# Altium schematic sheet MCU.SchDoc
size A4
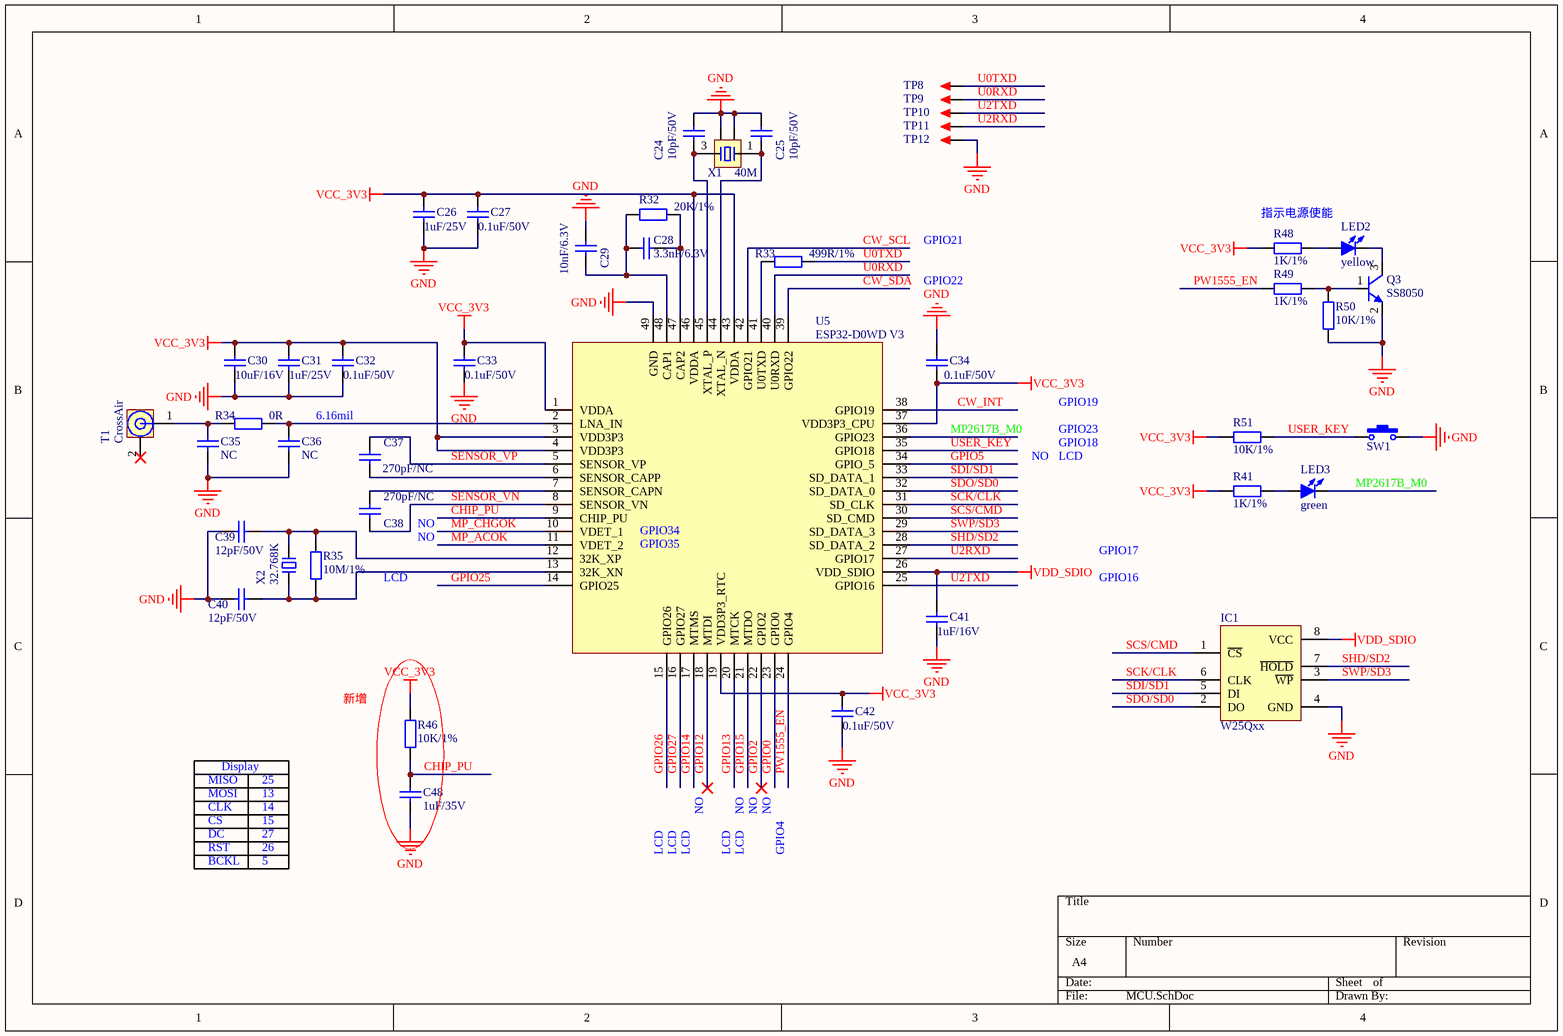
[diagram p0: MCU.SchDoc]

## Parts
C24  10pF/50V  [C0402_L]
C25  10pF/50V  [C0402_L]
C26  1uF/25V  [C0402_L]
C27  0.1uF/50V  [C0402_L]
C28  3.3nF/6.3V  [C0402_L]
C29  10nF/6.3V  [C0402_L]
C30  10uF/16V  [C0603_L]
C31  1uF/25V  [C0402_L]
C32  0.1uF/50V  [C0402_L]
C33  0.1uF/50V  [C0402_L]
C34  0.1uF/50V  [C0402_L]
C35  NC  [C0402_L]
C36  NC  [C0402_L]
C37  270pF/NC  [C0402_L]
C38  270pF/NC  [C0402_L]
C39  12pF/50V  [C0402_L]
C40  12pF/50V  [C0402_L]
C41  1uF/16V  [C0402_L]
C42  0.1uF/50V  [C0402_L]
C48  1uF/35V  [C0402_L]
IC1  W25Qxx  [SOP8W_L]
LED2  yellow  [LED0402]
LED3  green  [LED0402]
Q3  SS8050  [SOT23-3L]
R32  20K/1%  [R0402_L]
R33  499R/1%  [R0402_L]
R34  0R  [R0402_L]
R35  10M/1%  [R0402_L]
R41  1K/1%  [R0402_L]
R46  10K/1%  [R0402_L]
R48  1K/1%  [R0402_L]
R49  1K/1%  [R0402_L]
R50  10K/1%  [R0402_L]
R51  10K/1%  [R0402_L]
SW1  小龟侧按3x4  [小龟开关侧按键2脚贴片]  (value not drawn)
T1  CrossAir  [CA-C03]
TP8  TEST  [TEST 1]  (value not drawn)
TP9  TEST  [TEST 1]  (value not drawn)
TP10  TEST  [TEST 1]  (value not drawn)
TP11  TEST  [TEST 1]  (value not drawn)
TP12  TEST  [TEST 1]  (value not drawn)
U5  ESP32-D0WD V3  [QFN48_ESP32]
X1  40M  [XTAL-3225-4P]
X2  32.768K  [XTAL-3215-2P]

## Nets
GND: C24.2 C25.2 C26.1 C27.1 C29.2 C30.1 C31.1 C32.1 C33.1 C34.2 C35.1 C36.1 C39.1 C40.1 C41.1 C42.1 C48.1 IC1.4(GND) Q3.2(E) R50.1 SW1.2 TP12.1 U5.49(GND) X1.2 X1.4
VCC_3V3: C26.2 C27.2 C30.2 C31.2 C32.2 C33.2 C34.1 C42.2 R41.1 R46.2 R48.2 R51.1 U5.1(VDDA) U5.3(VDD3P3) U5.4(VDD3P3) U5.19(VDD3P3_RTC) U5.37(VDD3P3_CPU) U5.43(VDDA) U5.46(VDDA)
VDD_SDIO: C41.2 IC1.8(VCC) U5.26(VDD_SDIO)
CHIP_PU: C48.2 R46.1 U5.9(CHIP_PU)
CW_INT: U5.38(GPIO19)
CW_SCL: U5.42(GPIO21)
CW_SDA: U5.39(GPIO22)
GPIO0: U5.23(GPIO0)
GPIO2: U5.22(GPIO2)
GPIO5: U5.34(GPIO_5)
GPIO12: U5.18(MTDI)
GPIO13: U5.20(MTCK)
GPIO14: U5.17(MTMS)
GPIO15: U5.21(MTDO)
GPIO25: U5.14(GPIO25)
GPIO26: U5.15(GPIO26)
GPIO27: U5.16(GPIO27)
MP2617B_M0: LED3.2(K) U5.36(GPIO23)
MP_ACOK: U5.11(VDET_2)
MP_CHGOK: U5.10(VDET_1)
PW1555_EN: R49.1 U5.24(GPIO4)
SCK/CLK: IC1.6(CLK) U5.31(SD_CLK)
SCS/CMD: IC1.1(~{CS}) U5.30(SD_CMD)
SDI/SD1: IC1.5(DI) U5.33(SD_DATA_1)
SDO/SD0: IC1.2(DO) U5.32(SD_DATA_0)
SENSOR_VN: C38.1 U5.8(SENSOR_VN)
SENSOR_VP: C37.2 U5.5(SENSOR_VP)
SHD/SD2: IC1.7(~{HOLD}) U5.28(SD_DATA_2)
SWP/SD3: IC1.3(~{WP}) U5.29(SD_DATA_3)
U0RXD: TP9.1 U5.40(U0RXD)
U0TXD: R33.2 TP8.1
U2RXD: TP11.1 U5.27(GPIO17)
U2TXD: TP10.1 U5.25(GPIO16)
USER_KEY: R51.2 SW1.1 U5.35(GPIO18)
NetC24_1: C24.1 U5.45(XTAL_P) X1.3
NetC25_1: C25.1 U5.44(XTAL_N) X1.1
NetC28_1: C28.1 C29.1 R32.1 U5.48(CAP1)
NetC28_2: C28.2 R32.2 U5.47(CAP2)
NetC35_2: C35.2 R34.1 T1.1
NetC36_2: C36.2 R34.2 U5.2(LNA_IN)
NetC37_1: C37.1 U5.6(SENSOR_CAPP)
NetC38_2: C38.2 U5.7(SENSOR_CAPN)
NetC39_2: C39.2 R35.2 U5.12(32K_XP) X2.2
NetC40_2: C40.2 R35.1 U5.13(32K_XN) X2.1
NetLED2_1: LED2.1(A) R48.1
NetLED2_2: LED2.2(K) Q3.3(C)
NetLED3_1: LED3.1(A) R41.2
NetQ3_1: Q3.1(B) R49.2 R50.2
NetR33_1: R33.1 U5.41(U0TXD)

Not connected (* = marked no-connect by the designer): T1 2*

## Notes on the sheet
- GPIO21
- (near R48) 指示电源使能
- GPIO22
- 6.16mil
- GPIO19
- GPIO23
- GPIO18
- NO
- LCD
- (near C38) NO
- (near U5) GPIO34
- (near U5) GPIO35
- GPIO16
- GPIO17
- 新增
- MISO
- Display
- 25
- MOSI
- CLK
- CS
- DC
- RST
- 13
- 14
- 15
- 27
- 26
- GPIO4
- BCKL
- 5

## Library data of the parts
C24-C42 C48 = C: 贴片电容; BOM名称: 无极性贴片电容; 联系卖家，免费查找封装: 唯一出售店铺网址https://shop463601444.taobao.com
IC1 = W25Q: SPI Flash; BOM名称: 外置Flash; 联系卖家，免费查找封装: 唯一出售店铺网址https://shop463601444.taobao.com; 封装库来自淘宝卖家ID：黄晶宝石: 其他店铺购入均为盗版假冒封装库，请立即申请退款
LED2 LED3 = LED-SMD: 贴片LED; 联系卖家 免费查找封装: 封装库来自淘宝卖家ID：黄晶宝石; BOM名称: 贴片LED
Q3 = 8050-SMD: 高频放大-NPN型; 联系卖家，免费查找封装: 唯一出售店铺网址https://shop463601444.taobao.com; 参数: 40V 1.5A 1W 100MHZ; BOM名称: 高频放大-NPN型
R32-R35 R41 R46 R48-R51 = R: 贴片电阻; 联系卖家，免费查找封装: 唯一出售店铺网址https://shop463601444.taobao.com; BOM名称: 贴片电阻
SW1 = SW-PB: 微动开关; BOM名称: 3x6轻触开关; 联系卖家，免费查找封装: 唯一出售店铺网址https://shop463601444.taobao.com; 封装库来自淘宝卖家ID：黄晶宝石: 其他店铺购入均为盗版假冒封装库，请立即申请退款
T1 = CrossAir: 天线
TP8-TP12 = TEST: 测试点; 联系卖家，免费查找封装: 唯一出售店铺网址https://shop463601444.taobao.com; 封装库来自淘宝卖家ID：黄晶宝石: 其他店铺购入均为盗版假冒封装库，请立即申请退款; BOM名称: 测试点
U5 = ESP32-D0WD V3: ESP32
X1 = XTAL-4P: 4脚无源晶振(谐振器）; 联系卖家，免费查找封装: 唯一出售店铺网址https://shop463601444.taobao.com; BOM名称: 4脚无源晶振(谐振器）
X2 = XTAL-2P: 2脚无源晶振(谐振器）; 联系卖家，免费查找封装: 唯一出售店铺网址https://shop463601444.taobao.com; BOM名称: 2脚无源晶振(谐振器）